# EAGLE design LMR16030_SimpleSw_60-12V_2A_Buck-Converter (EAGLE 7.4.0)
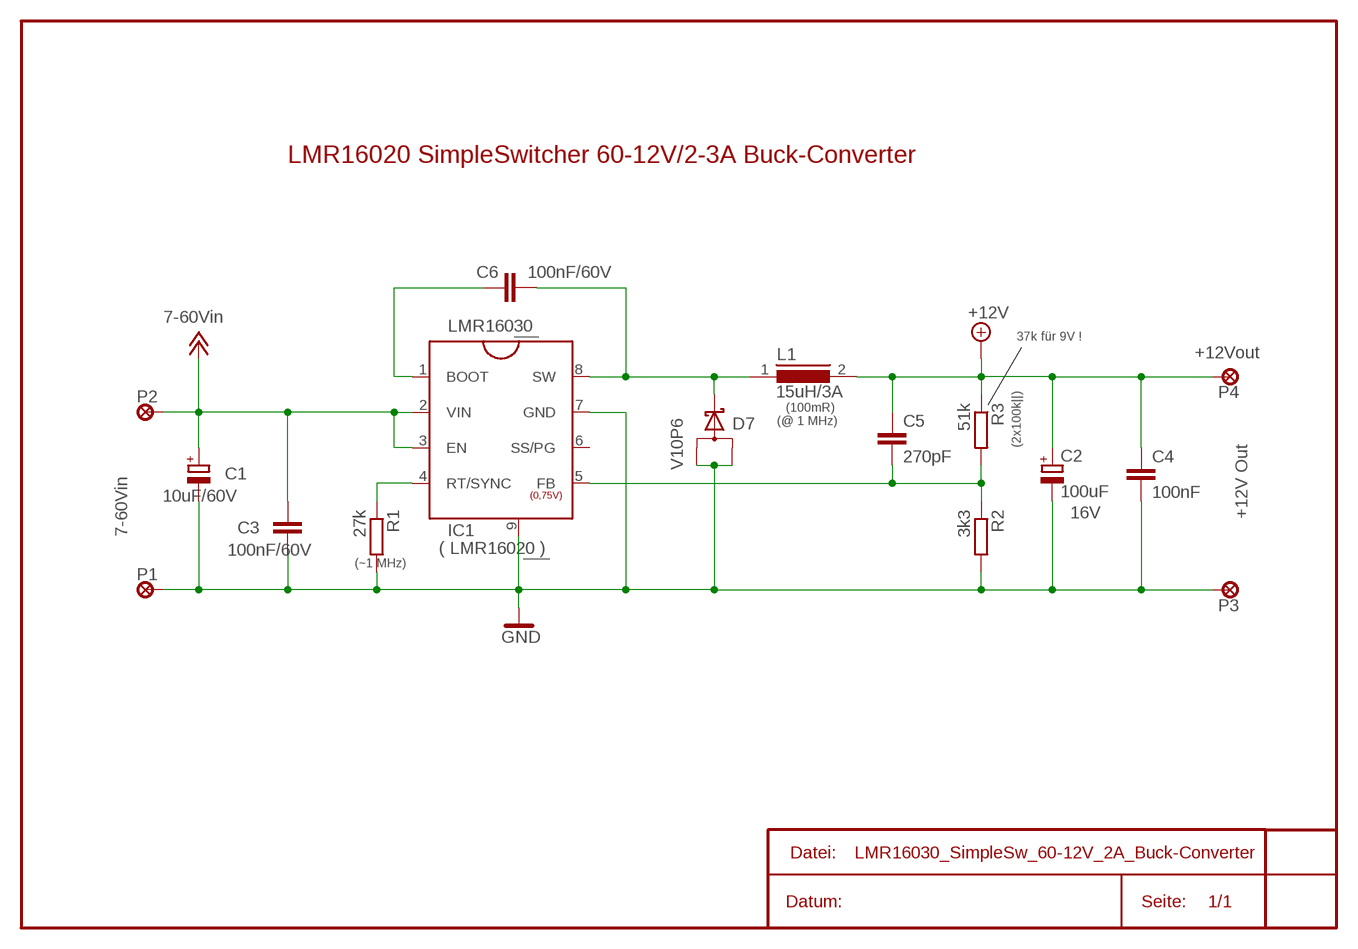
[diagram p0: schematic, sheet 1]

## Parts
C1  10uF/60V  CPOL-EUE3.5-8  [E3,5-8]
C2  100uF  CPOL-EUE3.5-8  [E3,5-8]
C3  100nF/60V  C-EUC0805  [C0805]
C4  100nF  C-EUC0805  [C0805]
C5  270pF  C-EUC0603K  [C0603K]
C6  100nF/60V  C-EUC0603K  [C0603K]
D7  V10P6  V12P10  [TO277A]
IC1  LMR16030  LMR16020  [SO8-POWERPAD]
L1  15uH/3A  SLF7045  [SLF7045]
P1  LSP15  [LSP15]
P2  LSP15  [LSP15]
P3  LSP15  [LSP15]
P4  LSP15  [LSP15]
R1  27k  R-EU_R0805  [R0805]
R2  3k3  R-EU_R0805  [R0805]
R3  51k  R-EU_R0805  [R0805]

## Nets
+5V: C2.+ C4.1 C5.1 L1.2 P4.P$1(MP) R3.1 ; supply symbol labelled +12V
+12V: C1.+ C3.1 IC1.2(VIN) IC1.3(EN) P2.P$1(MP)
GND: C1.- C2.- C3.2 C4.2 D7.A@1(A1) D7.A@2(A2) IC1.7(GND) IC1.9 P1.P$1(MP) P3.P$1(MP) R1.2 R2.2
N$1: IC1.4(RT/SYNC) R1.1
N$2: C6.2 D7.K IC1.8(SW) L1.1
N$3: C5.2 IC1.5(FB) R2.1 R3.2
N$4: C6.1 IC1.1(BOOT)
Unconnected: IC1.6(SS/PG)

## Notes on the sheet
- LMR16020 SimpleSwitcher 60-12V/2-3A Buck-Converter
- 7-60Vin
- 37k für 9V !
- +12Vout
- (100mR)
- (@ 1 MHz)
- (2x100k||)
- (0,75V)
- 16V | +12V Out
- 7-60Vin
- ( LMR16020 )
- (~1 MHz)

## Library data of the parts
C1 C2 = rcl1:CPOL-EU: POLARIZED CAPACITOR, European symbol
C3-C6 = rcl1:C-EU: CAPACITOR, European symbol
D7 = diode1:V12P10: Schottky-Diode 12A, 100V - TO-277A (SMPC)
IC1 = texas:LMR16020: LMR16020 Simple Switcher 60V, 2A Step-Down Converter with 40uA
L1 = inductors:SLF7045: SMD Inductors(Coils) For Power Line (Wound, Magnetic Shielded) Source: TDK, e531_slf7045.pdf
P1-P4 = solpad-smd:LSP15: SMD Solder-Pad (1.5mm Outer-Ø)
R1-R3 = rcl1:R-EU_: RESISTOR, European symbol

## Board
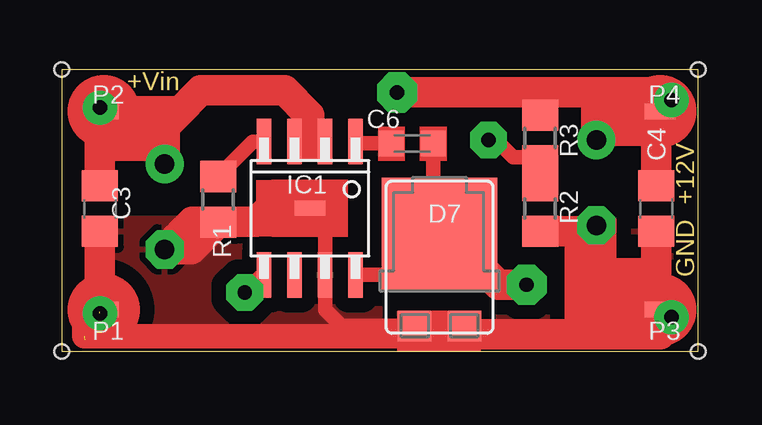
[diagram p1: board, top side]
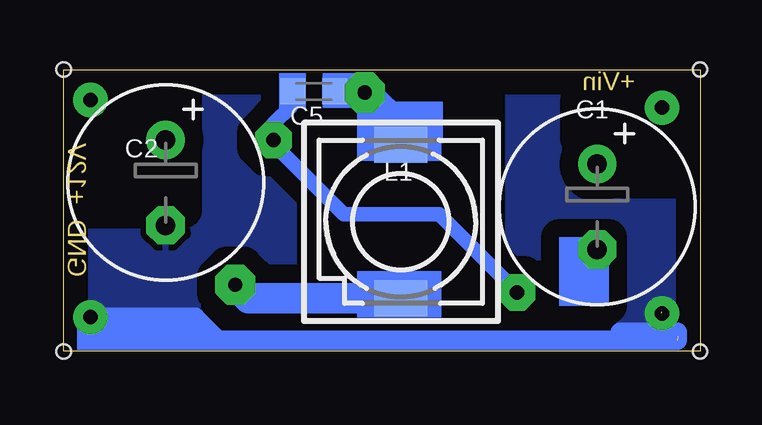
[diagram p2: board, bottom side, seen from below]

Size 26.51 x 11.75 mm. Coordinates in mm from the lower left corner, seen from the top.
Outline: 0,0 26.51,0 26.51,11.75 0,11.75 0,0
Copper layers (1*16): Top 0.035mm / dielectric 1.5mm / Bottom 0.035mm
Design rules "default": minimum track width 10mil, minimum drill 24mil, track to track 8mil, track to pad 8mil, pad to pad 8mil, via to via 8mil, smd to smd 8mil, copper to edge 40mil, drill to drill 8mil, minimum pad ring 10mil, minimum via ring 8mil, stop-mask expansion 4mil, vias tented up to drill 0mil, thermal gap 10mil
Holes 0.6 mm at 0,0 0,11.75 26.51,11.75 26.51,0
tRestrict: area 18.7,4 to 20.5,4.5; area 2.2,6.3 to 5.4,7.1
bRestrict: area 21.5,5.9 to 25.6,8.2; area 8.9,3.5 to 16,10.8; area 0.2,7.1 to 3.2,9.4; area 3.4,8.9 to 5.1,10.4; area 21.5,9 to 23.9,11

### Footprints (pad centres in the part's own frame; a part is rotated, then mirrored left to right if it is on the bottom)
E3,5-8 = drill 0.813 pad 1.6: + -1.778,0 | drill 0.813 pad 1.6 octagon: - 1.778,0
C0805 = smd 1.3 x 1.5: 1 -0.95,0; 2 0.95,0
C0603K = smd 1.05 x 1.08: 1 -0.875,0; 2 0.875,0
TO277A = smd 1.397 x 1.27: A@1 1.042,-3.813; A@2 -1.041,-3.813 | smd 4.801 x 4.724: K 0,0
SO8-POWERPAD = smd 0.61 x 1.905: 1 -1.905,-2.778; 2 -0.635,-2.778; 3 0.635,-2.778; 4 1.905,-2.778; 5 1.905,2.778; 6 0.635,2.778; 7 -0.635,2.778; 8 -1.905,2.778 | smd 1.27 x 0.635: 9 0,0
SLF7045 = smd 1.5 x 2.2: 1 -3.2,0; 2 3.2,0
LSP15 = smd 1.27 x 0.635: P$1 0,0
R0805 = smd 1.3 x 1.5: 1 -0.95,0; 2 0.95,0

### Placement (x,y rotation side)
C1  4.29,6.03 270 bottom
C2  22.27,7.04 270 bottom
C3  1.59,5.95 270 top
C4  24.77,5.95 270 top
C5  16.09,10.84 180 bottom
C6  14.6,8.67 0 top
D7  15.74,4.88 0 top
IC1  10.33,5.97 180 top
L1  12.47,5.41 90 bottom
P1  1.75,1.75 0 top
P2  1.75,10 0 top
P3  24.92,1.75 0 top
P4  24.92,10 0 top
R1  6.51,6.34 270 top
R2  19.92,5.95 270 top
R3  19.92,8.89 270 top

### Tracks (layer width: path | path; a pad name or v marks a point on that pad's centre or on a via)
+5V  (via drill 0.6 pad 1.42, 0.6 pad 1.68)
  Top 0.61: P4.P$1 v25.4,10.48
  Top 1.27: 22.27,10.79 24.92,10.79 P4.P$1 24.77,10 C4.1 | C2.+ 22.27,10.79 | 22.27,10.79 19.92,10.79 | 19.92,10.79 v13.97,10.79 | 19.92,10.79 R3.1
  Bottom 0.61: 12.47,9.02 L1.2 | 15.32,10.79 C5.1 14.01,10.84 v13.97,10.79
  Bottom 1.27: 12.47,9.02 12.46,9.32 v13.97,10.79
+12V  (via drill 0.6 pad 1.42)
  Top 0.61: IC1.3 10.32,8.75 IC1.2 | P2.P$1 1.75,10.16 v1.59,10.16
  Top 1.27: 10.32,8.75 10.32,9.84 9.29,10.87 5.79,10.87 4.8,9.88 | 4.8,9.88 4.29,9.37 C1.+ | 4.8,9.88 4.8,10 P2.P$1 1.59,10 C3.1
GND  (via drill 0.6 pad 1.42)  (2 unrouted)
  Top 0.61: D7.A@2 11.63,1.07 10.97,1.73 IC1.7 10.97,5.33 IC1.9 | 17.14,0.64 17.14,1.07 D7.A@1 | P3.P$1 25.08,1.75 | 21.97,5 22.12,5.26 C2.-
  Top 0.813: 22.27,0.84 22.23,0.71
  Top 1.016: D7.A@1 17.05,0.71 | 24.92,0.71 P3.P$1 | 17.14,0.64 0.94,0.64 0.94,1.75 P1.P$1
  Top 1.27: D7.A@1 | D7.A@1 D7.A@2 | 17.05,0.71 22.23,0.71 24.92,0.71 | R2.2 21.97,5 | 1.59,1.65 1.59,4.45 | R1.2 5.38,4.25 C1.- 5.43,5.4 8.1,5.4 8.67,5.97 IC1.9 | C2.- 22.27,1.43 v25.4,1.43 | 25.08,1.75 24.77,1.75 C4.2
  Bottom 0.813: v25.4,1.43 21.03,1.43 20.08,0.48 0.95,0.48 0.95,0.79 3.33,0.79
  other vias: 1.59,1.59
  pour Top (isolate 0.61): -0.16,11.91 26.67,11.91 26.67,-0.32 -0.16,-0.32
  pour Bottom (isolate 0.762): -0.16,11.91 26.67,11.91 26.67,-0.32 -0.16,-0.32
N$1
  Top 0.61: R1.1 6.51,7.31 7.95,8.75 IC1.4
N$2  (via drill 0.6 pad 1.68)
  Top 0.61: IC1.8 14.14,3.19 15.7,4.75 D7.K 15.47,5.15 C6.2
  Top 1.27: v19.37,2.78 18.18,2.78 16.39,4.56 D7.K
  Bottom 1.27: L1.1 18.8,2.21 v19.37,2.78
N$3  (via drill 0.6 pad 1.52)
  Top 0.61: IC1.5 8.43,3.11 8.27,3.11 v7.62,2.46 | R3.2 19.77,8.1 18.81,8.1 18.02,8.89 v17.78,8.81
  Top 1.27: R3.2 R2.1
  Bottom 0.61: v7.62,2.46 10.87,5.71 14.84,5.71 17.78,8.65 v17.78,8.81 17.78,9.48 17.06,10.2 C5.2
N$4
  Top 0.61: IC1.1 12.24,8.67 C6.1
(copper drawn outside any net)
  shapes: Bottom area x8, Top area x10

### Text on the board
Dimension: +Vin | +12V | GND
tValues: LMR16030